# EAGLE design adc2_v2 (EAGLE 5.12)
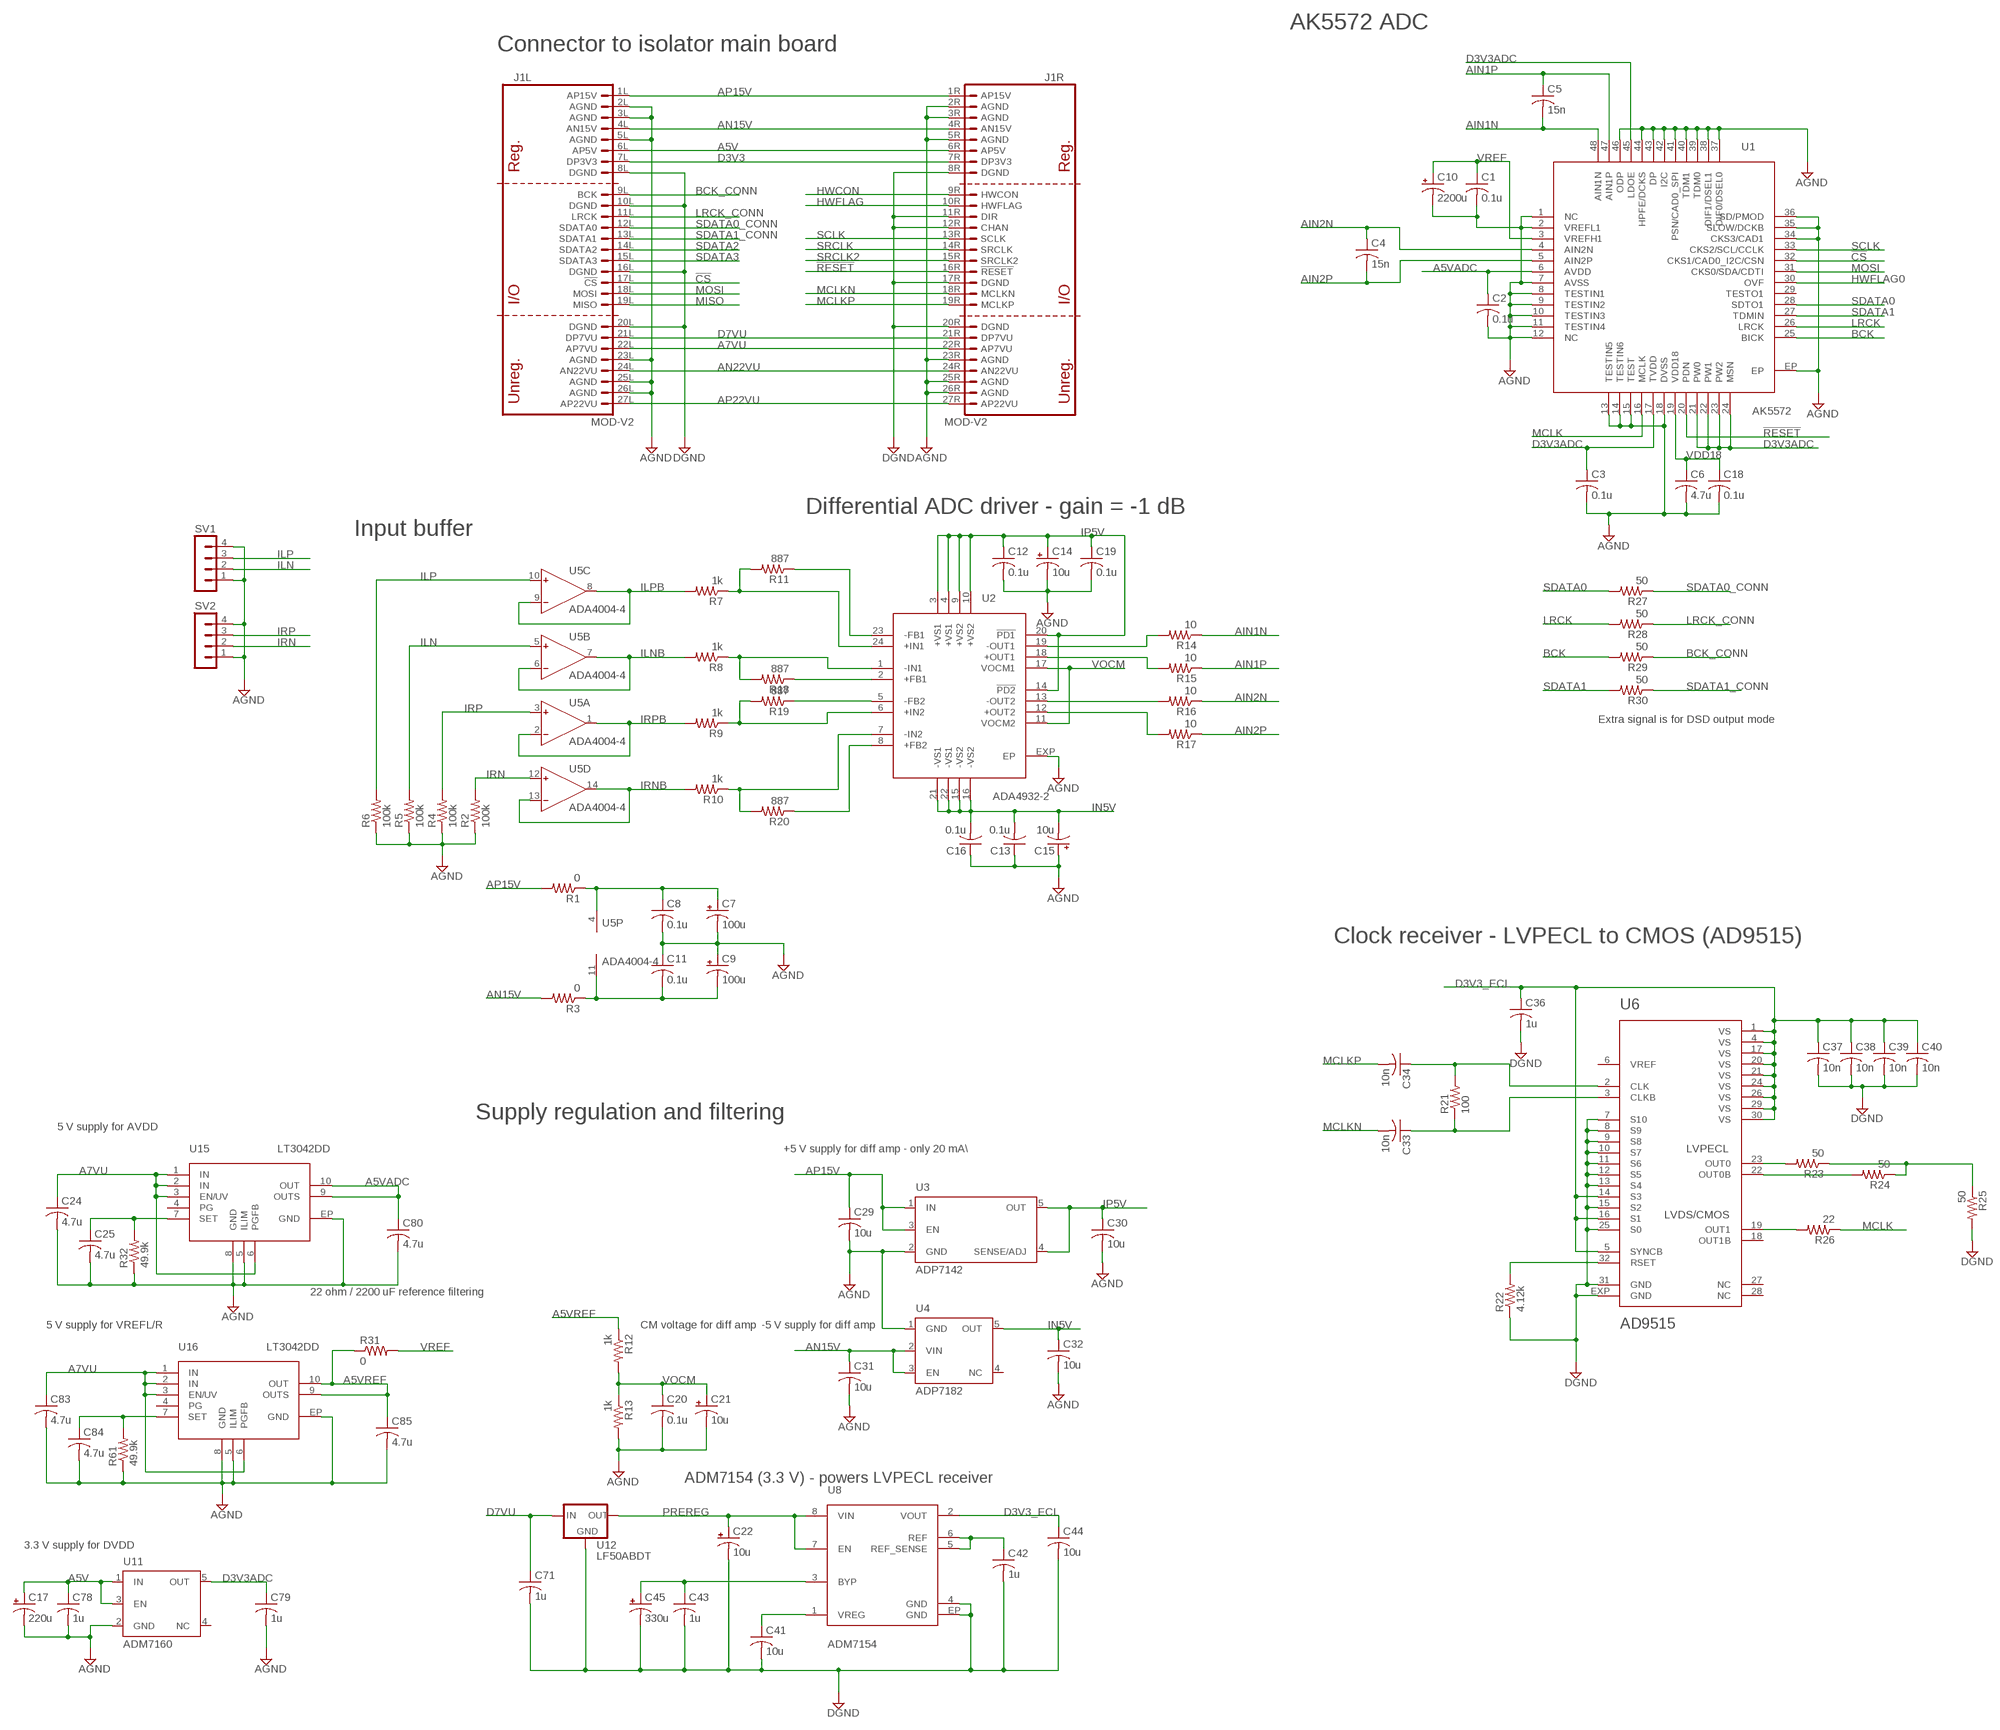
[diagram p0: schematic, sheet 1]

## Parts
C1  0.1u  C-USC0603  [C0603]
C2  0.1u  C-USC0603  [C0603]
C3  0.1u  C-USC0603  [C0603]
C4  15n  C-USC0603  [C0603]
C5  15n  C-USC0603  [C0603]
C6  4.7u  C-USC1206  [C1206]
C7  100u  CPOL-USE  [PANASONIC_E]
C8  0.1u  C-USC0603  [C0603]
C9  100u  CPOL-USE  [PANASONIC_E]
C10  2200u  CPOL-US  [PANASONIC_H13]
C11  0.1u  C-USC0603  [C0603]
C12  0.1u  C-USC0603  [C0603]
C13  0.1u  C-USC0603  [C0603]
C14  10u  CPOL-USB  [PANASONIC_B]
C15  10u  CPOL-USB  [PANASONIC_B]
C16  0.1u  C-USC0603  [C0603]
C17  220u  CPOL-USD  [PANASONIC_D]
C18  0.1u  C-USC0603  [C0603]
C19  0.1u  C-USC0603  [C0603]
C20  0.1u  C-USC0603  [C0603]
C21  10u  CPOL-USB  [PANASONIC_B]
C22  10u  CPOL-USB  [PANASONIC_B]
C24  4.7u  C-USC1206  [C1206]
C25  4.7u  C-USC1206  [C1206]
C29  10u  C-USC1206  [C1206]
C30  10u  C-USC1206  [C1206]
C31  10u  C-USC1206  [C1206]
C32  10u  C-USC1206  [C1206]
C33  10n  C-USC0603  [C0603]
C34  10n  C-USC0603  [C0603]
C36  1u  C-USC0805  [C0805]
C37  10n  C-USC0402  [C0402]
C38  10n  C-USC0402  [C0402]
C39  10n  C-USC0402  [C0402]
C40  10n  C-USC0402  [C0402]
C41  10u  C-USC1206  [C1206]
C42  1u  C-USC0805  [C0805]
C43  1u  C-USC0805  [C0805]
C44  10u  C-USC1206  [C1206]
C45  330u  CPOL-USCT7343  [CT7343]
C71  1u  C-USC0805  [C0805]
C78  1u  C-USC0603  [C0603]
C79  1u  C-USC0603  [C0603]
C80  4.7u  C-USC1206  [C1206]
C83  4.7u  C-USC1206  [C1206]
C84  4.7u  C-USC1206  [C1206]
C85  4.7u  C-USC1206  [C1206]
J1  MOD-V2  [MOD-V2]
R1  0  R-US_R0603  [R0603]
R2  100k  R-US_R0603  [R0603]
R3  0  R-US_R0603  [R0603]
R4  100k  R-US_R0603  [R0603]
R5  100k  R-US_R0603  [R0603]
R6  100k  R-US_R0603  [R0603]
R7  1k  R-US_R0603  [R0603]
R8  1k  R-US_R0603  [R0603]
R9  1k  R-US_R0603  [R0603]
R10  1k  R-US_R0603  [R0603]
R11  887  R-US_R0603  [R0603]
R12  1k  R-US_R0603  [R0603]
R13  1k  R-US_R0603  [R0603]
R14  10  R-US_R0603  [R0603]
R15  10  R-US_R0603  [R0603]
R16  10  R-US_R0603  [R0603]
R17  10  R-US_R0603  [R0603]
R18  887  R-US_R0603  [R0603]
R19  887  R-US_R0603  [R0603]
R20  887  R-US_R0603  [R0603]
R21  100  R-US_R0603  [R0603]
R22  4.12k  R-US_R0603  [R0603]
R23  50  R-US_R0603  [R0603]
R24  50  R-US_R0603  [R0603]
R25  50  R-US_R0603  [R0603]
R26  22  R-US_R0603  [R0603]
R27  50  R-US_R0603  [R0603]
R28  50  R-US_R0603  [R0603]
R29  50  R-US_R0603  [R0603]
R30  50  R-US_R0603  [R0603]
R31  0  R-US_R0603  [R0603]
R32  49.9k  R-US_R0603  [R0603]
R61  49.9k  R-US_R0603  [R0603]
SV1  MA04-1  [MA04-1]
SV2  MA04-1  [MA04-1]
U1  AK5572  [QFN48_EP_AKM]
U2  ADA4932-2  [LFCSP24]
U3  ADP7142  [SOT23-DBV]
U4  ADP7182  [SOT23-DBV]
U5  ADA4004-4  AD8644R  [SO14]
U6  AD9515  [LFCSP32]
U8  ADM7154  [SO8-EP]
U11  ADM7160  [SOT23-DBV]
U12  LF50ABDT  78XXS  [DPACK]
U15  LT3042DD  [DFN10]
U16  LT3042DD  [DFN10]

## Nets
!CS: J1.17L(L:!CS) U1.32(CKS1/CAD0_I2C/CSN)
!RESET: J1.16R(R:!RESET) U1.20(PDN)
A5V: C17.+ C78.1 J1.6L(L:AP5V) J1.6R(R:AP5V) U11.1(IN) U11.3(EN)
A5VADC: C2.1 C80.1 U1.6(AVDD) U15.9(OUTS) U15.10(OUT)
A5VREF: C85.1 R12.1 R31.1 U16.9(OUTS) U16.10(OUT)
A7VU: C24.1 C83.1 J1.22L(L:AP7VU) J1.22R(R:AP7VU) U15.1(IN) U15.2(IN) U15.3(EN/UV) U15.6(PGFB) U16.1(IN) U16.2(IN) U16.3(EN/UV) U16.6(PGFB)
AGND: C1.2 C2.2 C3.2 C6.2 C7.- C8.2 C9.+ C10.- C11.1 C12.2 C13.1 C14.- C15.+ C16.1 C17.- C18.2 C19.2 C20.2 C21.- C24.2 C25.2 C29.2 C30.2 C31.2 C32.2 C78.2 C79.2 C80.2 C83.2 C84.2 C85.2 J1.2L(L:AGND) J1.2R(R:AGND) J1.3L(L:AGND) J1.3R(R:AGND) J1.5L(L:AGND) J1.5R(R:AGND) J1.23L(L:AGND) J1.23R(R:AGND) J1.25L(L:AGND) J1.25R(R:AGND) J1.26L(L:AGND) J1.26R(R:AGND) R2.1 R4.1 R5.1 R6.1 R13.2 R32.1 R61.1 SV1.1 SV1.4 SV2.1 SV2.4 U1.1(NC) U1.2(VREFL1) U1.7(AVSS) U1.8(TESTIN1) U1.9(TESTIN2) U1.10(TESTIN3) U1.11(TESTIN4) U1.12(NC) U1.13(TESTIN5) U1.14(TESTIN6) U1.15(TEST) U1.18(DVSS) U1.34(CKS3/CAD1) U1.35(SLOW/DCKB) U1.36(SD/PMOD) U1.37(DIF0/DSEL0) U1.38(DIF1/DSEL1) U1.39(TDM0) U1.40(TDM1) U1.41(PSN/CAD0_SPI) U1.42(I2C) U1.43(DP) U1.44(HPFE/DCKS) U1.46(ODP) U1.EP U2.EXP(EP) U3.2(GND) U4.1(GND) U11.2(GND) U15.5(ILIM) U15.8(GND) U15.EP(GND) U16.5(ILIM) U16.8(GND) U16.EP(GND)
AIN1N: C5.2 R14.1 U1.48(AIN1N)
AIN1P: C5.1 R15.1 U1.47(AIN1P)
AIN2N: C4.1 R16.1 U1.4(AIN2N)
AIN2P: C4.2 R17.1 U1.5(AIN2P)
AN15V: C31.1 J1.4L(L:AN15V) J1.4R(R:AN15V) R3.2 U4.2(VIN) U4.3(EN)
AN22VU: J1.24L(L:AN22VU) J1.24R(R:AN22VU)
AP15V: C29.1 J1.1L(L:AP15V) J1.1R(R:AP15V) R1.2 U3.1(IN) U3.3(EN)
AP22VU: J1.27L(L:AP22VU) J1.27R(R:AP22VU)
BCK: R29.2 U1.25(BICK)
BCK_CONN: J1.9L(L:BCK) R29.1
D3V3: J1.7L(L:DP3V3) J1.7R(R:DP3V3)
D3V3_ECL: C36.1 C37.1 C38.1 C39.1 C40.1 C44.1 U6.1(VS) U6.4(VS) U6.5(SYNCB) U6.14(S3) U6.16(S1) U6.17(VS) U6.20(VS) U6.21(VS) U6.24(VS) U6.26(VS) U6.29(VS) U6.30(VS) U8.2(VOUT)
D3V3ADC: C3.1 C79.1 U1.17(TVDD) U1.21(PW0) U1.22(PW1) U1.23(PW2) U1.24(MSN) U1.45(LDOE) U11.5(OUT)
D7VU: C71.1 J1.21L(L:DP7VU) J1.21R(R:DP7VU) U12.1(IN)
DGND: C22.- C36.2 C37.2 C38.2 C39.2 C40.2 C41.2 C42.2 C43.2 C44.2 C45.- C71.2 J1.8L(L:DGND) J1.8R(R:DGND) J1.10L(L:DGND) J1.11R(R:DIR) J1.12R(R:CHAN) J1.16L(L:DGND) J1.17R(R:DGND) J1.20L(L:DGND) J1.20R(R:DGND) R22.1 R25.2 U6.7(S10) U6.8(S9) U6.9(S8) U6.10(S7) U6.11(S6) U6.12(S5) U6.13(S4) U6.15(S2) U6.25(S0) U6.31(GND) U6.EXP(GND) U8.4(GND) U8.EP(GND) U12.4(GND)
HWCON: J1.9R(R:HWCON)
HWFLAG: J1.10R(R:HWFLAG)
HWFLAG0: U1.30(OVF)
ILN: R5.2 SV1.2 U5.5(B:IN+)
ILNB: R8.2 U5.6(B:IN-) U5.7(B:OUT)
ILP: R6.2 SV1.3 U5.10(C:IN+)
ILPB: R7.2 U5.8(C:OUT) U5.9(C:IN-)
IN5V: C13.2 C15.- C16.2 C32.1 U2.15(-VS2) U2.16(-VS2) U2.21(-VS1) U2.22(-VS1) U4.5(OUT)
IP5V: C12.1 C14.+ C19.1 C30.1 U2.3(+VS1) U2.4(+VS1) U2.9(+VS2) U2.10(+VS2) U2.14(!PD2) U2.20(!PD1) U3.4(SENSE/ADJ) U3.5(OUT)
IRN: R2.2 SV2.2 U5.12(D:IN+)
IRNB: R10.2 U5.13(D:IN-) U5.14(D:OUT)
IRP: R4.2 SV2.3 U5.3(A:IN+)
IRPB: R9.2 U5.1(A:OUT) U5.2(A:IN-)
LRCK: R28.2 U1.26(LRCK)
LRCK_CONN: J1.11L(L:LRCK) R28.1
MCLK: R26.1 U1.16(MCLK)
MCLKN: C33.2 J1.18R(R:MCLKN)
MCLKP: C34.2 J1.19R(R:MCLKP)
MISO: J1.19L(L:MISO)
MOSI: J1.18L(L:MOSI) U1.31(CKS0/SDA/CDTI)
N$1: C9.- C11.2 R3.1 U5.11(P:V-)
N$2: R7.1 R11.2 U2.24(+IN1)
N$3: R15.2 U2.18(+OUT1)
N$4: R14.2 U2.19(-OUT1)
N$5: R16.2 U2.13(-OUT2)
N$6: R17.2 U2.12(+OUT2)
N$7: R8.1 R18.2 U2.1(-IN1)
N$8: R9.1 R19.2 U2.6(+IN2)
N$11: R10.1 R20.2 U2.7(-IN2)
N$12: R18.1 U2.2(+FB1)
N$13: R19.1 U2.5(-FB2)
N$14: R11.1 U2.23(-FB1)
N$15: R20.1 U2.8(+FB2)
N$16: C34.1 R21.2 U6.2(CLK)
N$17: C33.1 R21.1 U6.3(CLKB)
N$18: R23.2 U6.23(OUT0)
N$19: C41.1 U8.1(VREG)
N$20: C7.+ C8.1 R1.1 U5.4(P:V+)
N$22: R26.2 U6.19(OUT1)
N$25: R24.2 U6.22(OUT0B)
N$26: C43.1 C45.+ U8.3(BYP)
N$27: R22.2 U6.32(RSET)
N$28: C42.1 U8.5(REF_SENSE) U8.6(REF)
N$29: R23.1 R24.1 R25.1
N$72: C25.1 R32.2 U15.7(SET)
N$73: C84.1 R61.2 U16.7(SET)
PREREG: C22.+ U8.7(EN) U8.8(VIN) U12.3(OUT)
SCLK: J1.13R(R:SCLK) U1.33(CKS2/SCL/CCLK)
SDATA0: R27.2 U1.28(SDTO1)
SDATA0_CONN: J1.12L(L:SDATA0) R27.1
SDATA1: R30.2 U1.27(TDMIN)
SDATA1_CONN: J1.13L(L:SDATA1) R30.1
SDATA2: J1.14L(L:SDATA2)
SDATA3: J1.15L(L:SDATA3)
SRCLK: J1.14R(R:SRCLK)
SRCLK2: J1.15R(R:SRCLK2)
VDD18: C6.1 C18.1 U1.19(VDD18)
VOCM: C20.1 C21.+ R12.2 R13.1 U2.11(VOCM2) U2.17(VOCM1)
VREF: C1.1 C10.+ R31.2 U1.3(VREFH1)
Unconnected: U1.29(TESTO1) U4.4(NC) U6.6(VREF) U6.18(OUT1B) U6.27(NC) U6.28(NC) U11.4(NC) U15.4(PG) U16.4(PG)

## Notes on the sheet
- AK5572 ADC
- Connector to isolator main board
- Differential ADC driver - gain = -1 dB
- Input buffer
- Extra signal is for DSD output mode
- Clock receiver - LVPECL to CMOS (AD9515)
- Supply regulation and filtering
- 5 V supply for AVDD
- +5 V supply for diff amp - only 20 mA\
- 22 ohm / 2200 uF reference filtering
- 5 V supply for VREFL/R | CM voltage for diff amp | -5 V supply for diff amp
- ADM7154 (3.3 V) - powers LVPECL receiver
- 3.3 V supply for DVDD

## Library data of the parts
C1-C6 C8 C11-C13 C16 C18-C20 C24 C25 C29-C34 C36-C44 C71 C78-C80 C83-C85 = rcl:C-US: CAPACITOR, American symbol
C7 C9 C14 C15 C17 C21 C22 C45 = rcl:CPOL-US: POLARIZED CAPACITOR, American symbol
C10 = cdp:CPOL-US
J1 = cdp:MOD-V2
R1-R32 R61 = rcl:R-US_: RESISTOR, American symbol
SV1 SV2 = con-lstb:MA04-1: PIN HEADER; OC_FARNELL: unknown; OC_NEWARK: unknown
U1 = cdp:AK5572
U2 = cdp:ADA4932-2
U3 = cdp:ADP7142
U4 = cdp:ADP7182
U5 = analog-devices:AD8644: Single and Quad 18 V Operational Amplifiers Source: http://www.analog.com/static/imported-files/data_sheets/AD8614_8644.pdf; MF: ALTERA CORPORATION; MPN: AD8644ARZ; OC_FARNELL: 1438873; OC_NEWARK: 59K7037
U6 = cdp:AD9515
U8 = cdp:ADM7154
U11 = cdp:ADM7160
U12 = cdp:78XXS: VOLTAGE REGULATOR
U15 U16 = cdp:LT3042

## Board
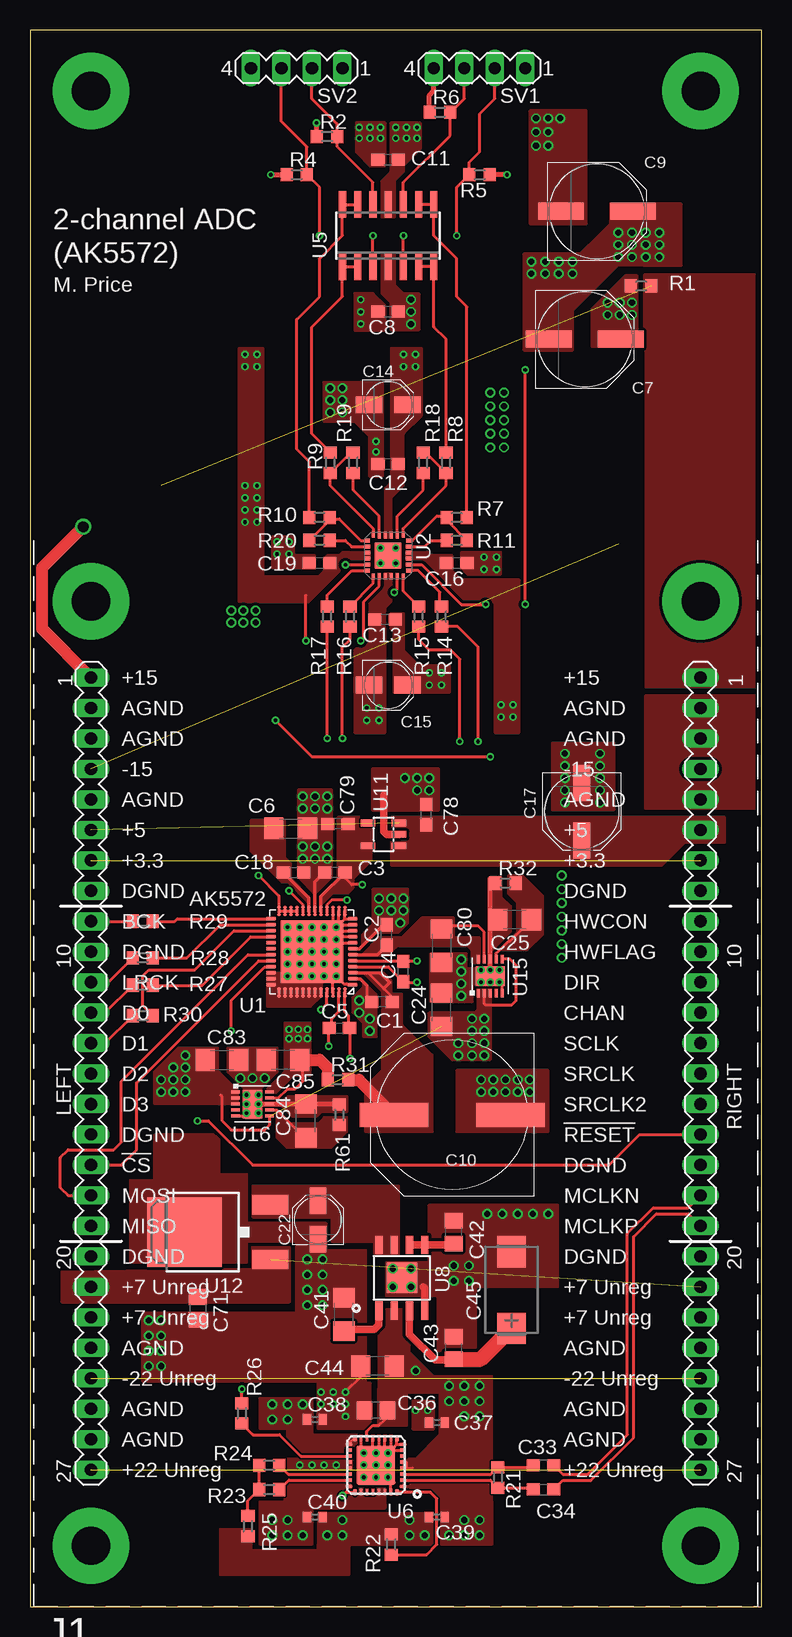
[diagram p1: board, top side]
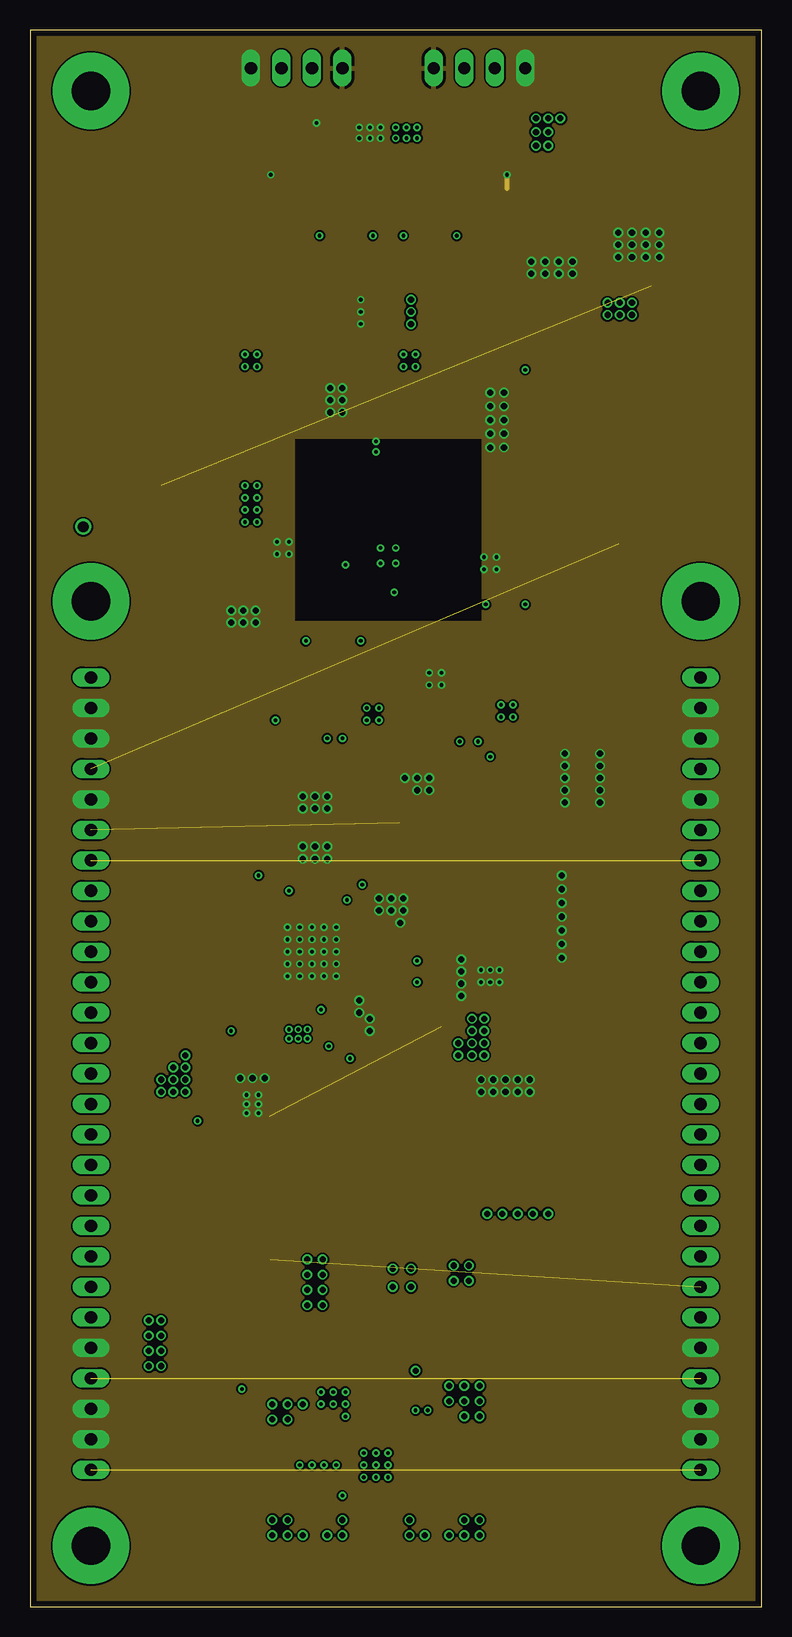
[diagram p2: board, inner layer Route2]
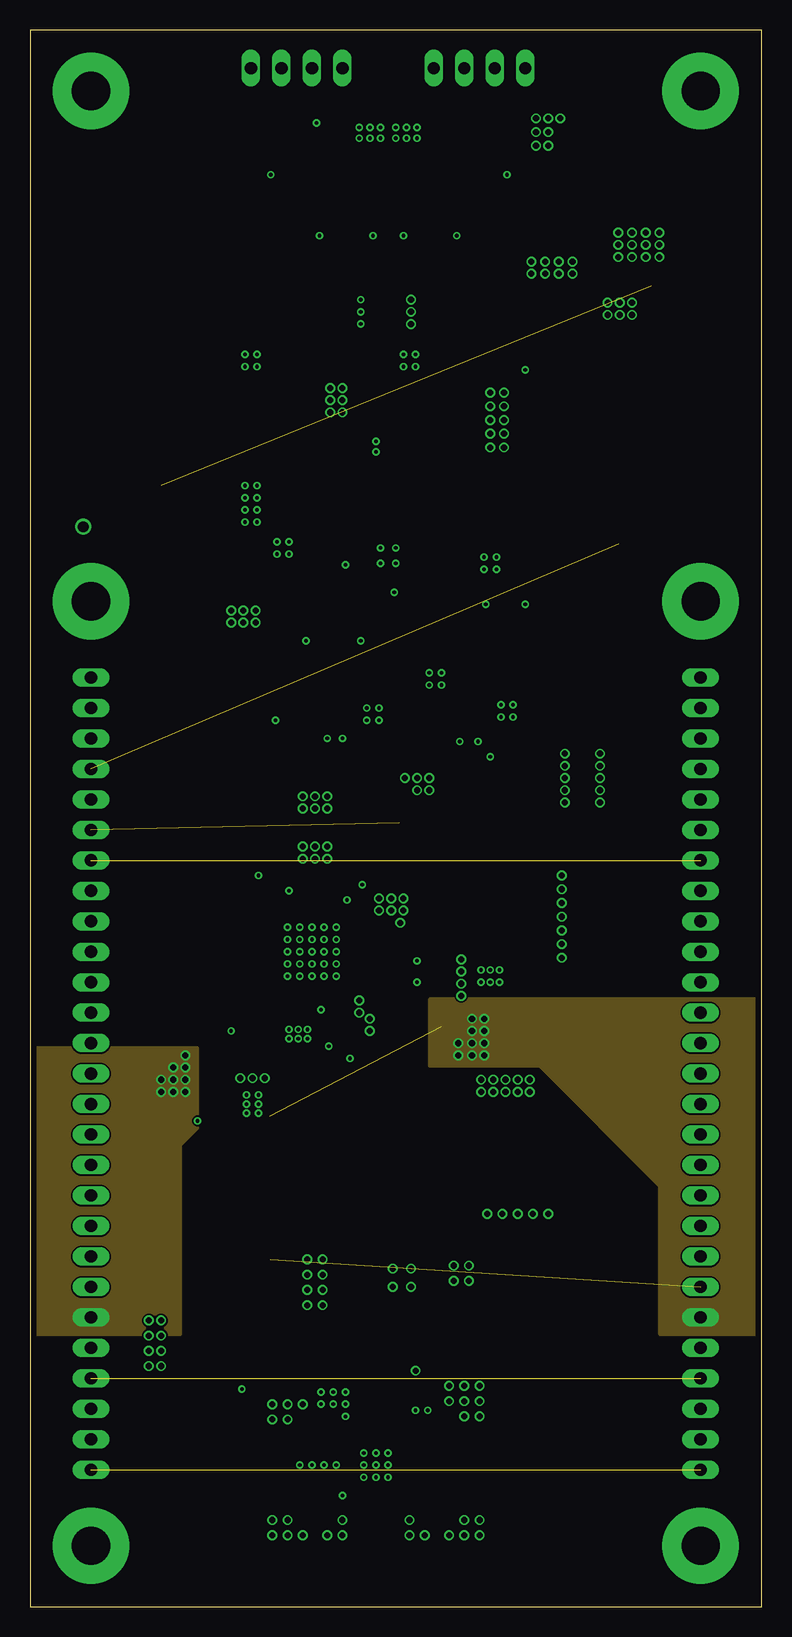
[diagram p3: board, inner layer Route15]
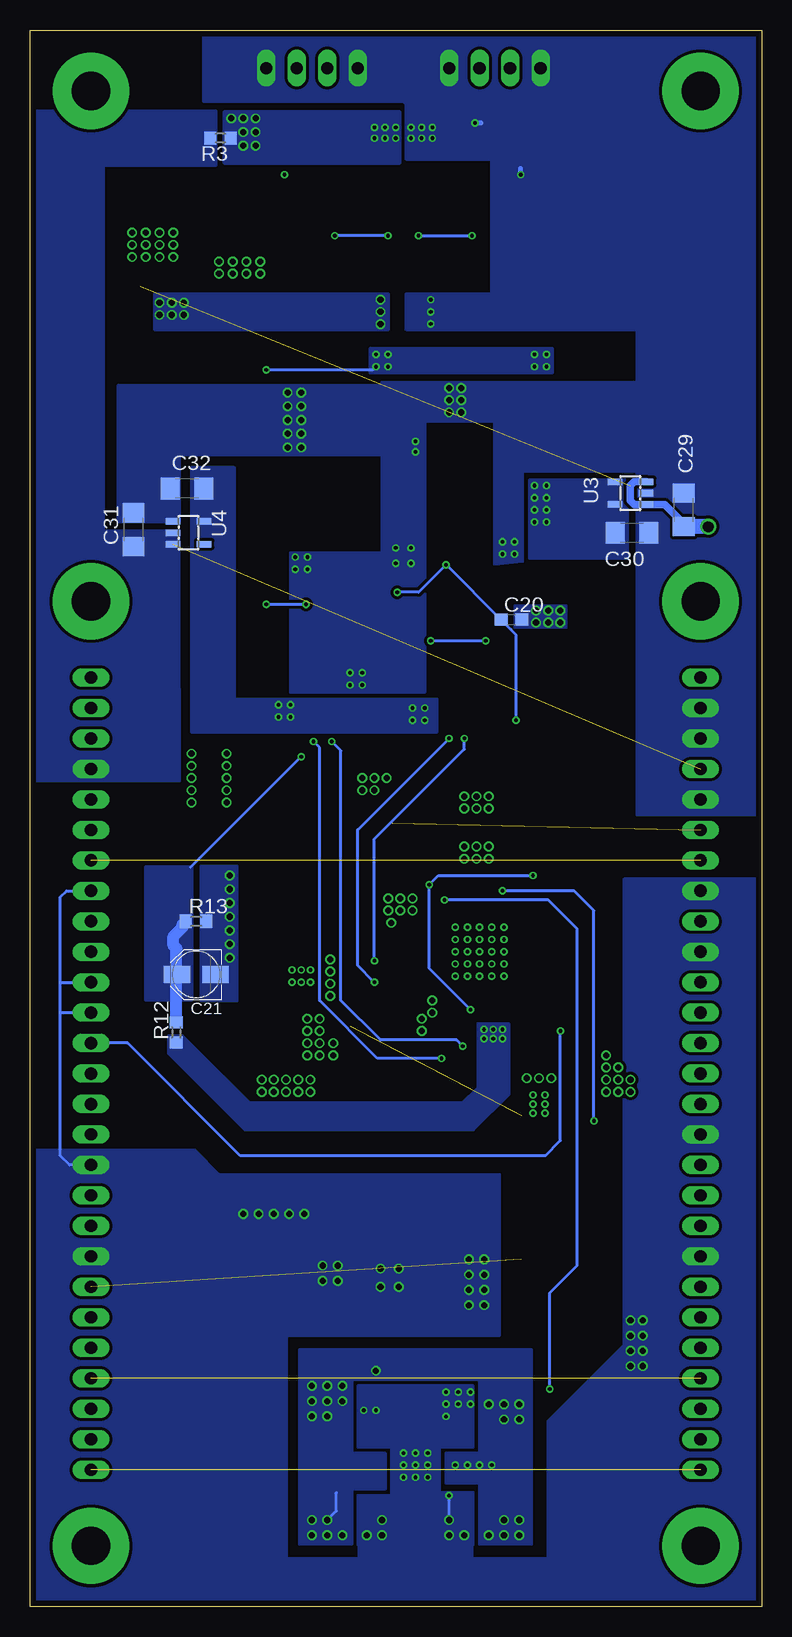
[diagram p4: board, bottom side, seen from below]

Size 60.96 x 131.44 mm. Coordinates in mm from the lower left corner, seen from the top.
Outline: 0,0 60.96,0 60.96,131.44 0,131.44 0,0
Copper layers (1*2*15*16): Top 0.035mm / dielectric 0.2mm / Route2 0.035mm / dielectric 1.2mm / Route15 0.035mm / dielectric 0.2mm / Bottom 0.035mm
Design rules "Elecrow_4-layer_PCB_eagle_rule": minimum track width 6mil, minimum drill 12mil, track to track 6mil, track to pad 6mil, pad to pad 6mil, via to via 8mil, smd to smd 0mil, copper to edge 20mil, drill to drill 10mil, minimum pad ring 6mil, minimum via ring 6mil, stop-mask expansion 0mil, vias tented up to drill 100mil, thermal gap 10mil

### Footprints (pad centres in the part's own frame; a part is rotated, then mirrored left to right if it is on the bottom)
C0603 = smd 1.1 x 1: 1 -0.85,0; 2 0.85,0
C1206 = smd 1.6 x 1.8: 1 -1.4,0; 2 1.4,0
PANASONIC_E = smd 3.8 x 1.4: + 3,0; - -3,0
PANASONIC_H13 = smd 5.7 x 2: + 4.85,0; - -4.85,0
PANASONIC_B = smd 2.2 x 1.4: + 1.6,0; - -1.6,0
PANASONIC_D = smd 3 x 1.4: + 2.4,0; - -2.4,0
C0805 = smd 1.3 x 1.5: 1 -0.95,0; 2 0.95,0
C0402 = smd 0.7 x 0.9: 1 -0.65,0; 2 0.65,0
CT7343 = smd 2.6 x 2.4: + -3.2,0; - 3.2,0
MOD-V2 = drill 1.016 long: 1L -25.4,33.02; 1R 25.4,33.02; 2L -25.4,30.48; 2R 25.4,30.48; 3L -25.4,27.94; 3R 25.4,27.94; 4L -25.4,25.4; 4R 25.4,25.4; 5L -25.4,22.86; 5R 25.4,22.86; 6L -25.4,20.32; 6R 25.4,20.32; 7L -25.4,17.78; 7R 25.4,17.78; 8L -25.4,15.24; 8R 25.4,15.24; 9L -25.4,12.7; 9R 25.4,12.7; 10L -25.4,10.16; 10R 25.4,10.16; 11L -25.4,7.62; 11R 25.4,7.62; 12L -25.4,5.08; 12R 25.4,5.08; 13L -25.4,2.54; 13R 25.4,2.54; 14L -25.4,0; 14R 25.4,0; 15L -25.4,-2.54; 15R 25.4,-2.54; 16L -25.4,-5.08; 16R 25.4,-5.08; 17L -25.4,-7.62; 17R 25.4,-7.62; 18L -25.4,-10.16; 18R 25.4,-10.16; 19L -25.4,-12.7; 19R 25.4,-12.7; 20L -25.4,-15.24; 20R 25.4,-15.24; 21L -25.4,-17.78; 21R 25.4,-17.78; 22L -25.4,-20.32; 22R 25.4,-20.32; 23L -25.4,-22.86; 23R 25.4,-22.86; 24L -25.4,-25.4; 24R 25.4,-25.4; 25L -25.4,-27.94; 25R 25.4,-27.94; 26L -25.4,-30.48; 26R 25.4,-30.48; 27L -25.4,-33.02; 27R 25.4,-33.02 | drill 3.175 pad 6.35 round: DP1 -25.4,39.37; DP2 25.4,39.37; DP3 -25.4,-39.37; DP4 25.4,-39.37
R0603 = smd 1 x 1.1: 1 -0.85,0; 2 0.85,0
MA04-1 = drill 1.016 long: 1 -3.81,0; 2 -1.27,0; 3 1.27,0; 4 3.81,0
QFN48_EP_AKM = smd 0.8 x 0.3: 1 -3.4,2.75; 2 -3.4,2.25; 3 -3.4,1.75; 4 -3.4,1.25; 5 -3.4,0.75; 6 -3.4,0.25; 7 -3.4,-0.25; 8 -3.4,-0.75; 9 -3.4,-1.25; 10 -3.4,-1.75; 11 -3.4,-2.25; 12 -3.4,-2.75; 25 3.4,-2.75; 26 3.4,-2.25; 27 3.4,-1.75; 28 3.4,-1.25; 29 3.4,-0.75; 30 3.4,-0.25; 31 3.4,0.25; 32 3.4,0.75; 33 3.4,1.25; 34 3.4,1.75; 35 3.4,2.25; 36 3.4,2.75 | smd 0.3 x 0.8: 13 -2.75,-3.4; 14 -2.25,-3.4; 15 -1.75,-3.4; 16 -1.25,-3.4; 17 -0.75,-3.4; 18 -0.25,-3.4; 19 0.25,-3.4; 20 0.75,-3.4; 21 1.25,-3.4; 22 1.75,-3.4; 23 2.25,-3.4; 24 2.75,-3.4; 37 2.75,3.4; 38 2.25,3.4; 39 1.75,3.4; 40 1.25,3.4; 41 0.75,3.4; 42 0.25,3.4; 43 -0.25,3.4; 44 -0.75,3.4; 45 -1.25,3.4; 46 -1.75,3.4; 47 -2.25,3.4; 48 -2.75,3.4 | smd 5.2 x 5.2: EP 0,0
LFCSP24 = smd 0.5 x 0.3: 1 -1.75,1.25; 6 -1.75,-1.25; 13 1.75,-1.25; 18 1.75,1.25 | smd 0.55 x 0.3: 2 -1.725,0.75; 3 -1.725,0.25; 4 -1.725,-0.25; 5 -1.725,-0.75; 14 1.725,-0.75; 15 1.725,-0.25; 16 1.725,0.25; 17 1.725,0.75 | smd 0.3 x 0.5: 7 -1.25,-1.75; 12 1.25,-1.75; 19 1.25,1.75; 24 -1.25,1.75 | smd 0.3 x 0.55: 8 -0.75,-1.725; 9 -0.25,-1.725; 10 0.25,-1.725; 11 0.75,-1.725; 20 0.75,1.725; 21 0.25,1.725; 22 -0.25,1.725; 23 -0.75,1.725 | smd 2.25 x 2.25: EXP 0,0
SOT23-DBV = smd 0.55 x 1.2: 1 -0.95,-1.3; 2 0,-1.3; 3 0.95,-1.3; 4 0.95,1.3; 5 -0.95,1.3
SO14 = smd 0.6 x 2.2: 1 -3.81,-2.6; 2 -2.54,-2.6; 3 -1.27,-2.6; 4 0,-2.6; 5 1.27,-2.6; 6 2.54,-2.6; 7 3.81,-2.6; 8 3.81,2.6; 9 2.54,2.6; 10 1.27,2.6; 11 0,2.6; 12 -1.27,2.6; 13 -2.54,2.6; 14 -3.81,2.6
LFCSP32 = smd 0.55 x 0.3: 1 -2.25,1.75; 2 -2.25,1.25; 3 -2.25,0.75; 4 -2.25,0.25; 5 -2.25,-0.25; 6 -2.25,-0.75; 7 -2.25,-1.25; 8 -2.25,-1.75; 17 2.25,-1.75; 18 2.25,-1.25; 19 2.25,-0.75; 20 2.25,-0.25; 21 2.25,0.25; 22 2.25,0.75; 23 2.25,1.25; 24 2.25,1.75 | smd 0.3 x 0.55: 9 -1.75,-2.25; 10 -1.25,-2.25; 11 -0.75,-2.25; 12 -0.25,-2.25; 13 0.25,-2.25; 14 0.75,-2.25; 15 1.25,-2.25; 16 1.75,-2.25; 25 1.75,2.25; 26 1.25,2.25; 27 0.75,2.25; 28 0.25,2.25; 29 -0.25,2.25; 30 -0.75,2.25; 31 -1.25,2.25; 32 -1.75,2.25 | smd 3.25 x 3.25: EXP 0,0
SO8-EP = smd 0.61 x 1.524: 1 -1.905,-2.743; 2 -0.635,-2.743; 3 0.635,-2.743; 4 1.905,-2.743; 5 1.905,2.743; 6 0.635,2.743; 7 -0.635,2.743; 8 -1.905,2.743 | smd 2.54 x 2.54: EP 0,0
DPACK = smd 1.6 x 3: 1 -2.28,-4.8; 3 2.28,-4.8 | smd 5.8 x 6.2: 4 0,2.38
DFN10 = smd 0.25 x 0.7: 1 -1,-1.425; 2 -0.5,-1.425; 3 0,-1.425; 4 0.5,-1.425; 5 1,-1.425; 6 1,1.425; 7 0.5,1.425; 8 0,1.425; 9 -0.5,1.425; 10 -1,1.425 | smd 2.38 x 1.65: EP 0,0

### Placement (x,y rotation side)
C1  29.34,50.42 180 top
C2  29.72,56.01 90 top
C3  25.4,61.21 180 top
C4  31.11,52.96 90 top
C5  25.78,48.26 0 top
C6  21.72,64.9 0 top
C7  46.23,105.66 0 top
C8  29.84,107.95 180 top
C9  47.24,116.33 0 top
C10  35.18,41.02 180 top
C11  29.84,120.65 0 top
C12  29.84,95.25 180 top
C13  29.59,82.3 180 top
C14  29.84,100.2 0 top
C15  29.84,76.83 0 top
C16  35.56,87 180 top
C17  45.97,66.29 270 top
C18  21.97,61.21 0 top
C19  24.13,87 180 top
C20  20.83,82.3 0 bottom
C21  47.12,52.7 180 bottom
C22  24,32.26 90 top
C24  34.29,49.78 90 top
C25  40.39,57.28 180 top
C29  6.48,91.44 90 bottom
C30  10.79,89.53 0 bottom
C31  52.32,89.79 90 bottom
C32  47.88,93.22 180 bottom
C33  42.8,11.81 0 top
C34  42.8,9.78 0 top
C36  28.83,16.38 180 top
C37  33.91,15.37 180 top
C38  23.75,15.62 0 top
C39  33.91,7.49 180 top
C40  23.75,7.49 0 top
C41  26.16,24.38 90 top
C42  35.31,31.24 90 top
C43  35.31,21.59 90 top
C44  28.96,20.07 180 top
C45  40.13,26.42 90 top
C71  13.97,24.89 270 top
C78  33.02,66.04 90 top
C79  25.65,65.28 180 top
C80  34.29,55.12 270 top
C83  16,45.59 0 top
C84  22.99,40.51 90 top
C85  21.08,45.59 180 top
J1  30.48,44.45 0 top
R1  50.93,110.11 0 top
R2  24.77,122.56 0 top
R3  45.09,122.43 180 bottom
R4  22.23,119.38 0 top
R5  37.47,119.38 180 top
R6  34.16,124.59 0 top
R7  35.56,90.81 0 top
R8  34.67,95.38 90 top
R9  25.02,95.38 90 top
R10  24.13,90.81 180 top
R11  35.56,88.9 0 top
R12  48.77,47.88 90 bottom
R13  47.12,57.15 0 bottom
R14  34.29,82.55 90 top
R15  32.38,82.55 90 top
R16  26.67,82.55 90 top
R17  24.77,82.55 90 top
R18  32.77,95.38 90 top
R19  26.92,95.38 90 top
R20  24.13,88.9 180 top
R21  38.99,10.79 270 top
R22  30.1,5.21 270 top
R23  19.94,9.78 0 top
R24  19.94,11.81 0 top
R25  18.16,6.73 270 top
R26  17.65,16.13 270 top
R27  9.4,51.82 0 top
R28  9.4,54.1 0 top
R29  9.4,57.15 0 top
R30  9.4,49.28 0 top
R31  25.65,43.94 0 top
R32  39.62,60.33 0 top
R61  25.78,41.02 270 top
SV1  37.47,128.27 180 top
SV2  22.23,128.27 180 top
U1  23.5,54.61 180 top
U2  29.84,87.63 270 top
U3  10.92,92.84 90 bottom
U4  47.75,89.53 270 bottom
U5  29.84,114.3 0 top
U6  28.83,11.81 180 top
U8  30.99,27.43 0 top
U11  29.46,64.39 90 top
U12  15.24,31.24 90 top
U15  38.35,52.58 0 top
U16  18.54,41.91 270 top

### Tracks (layer width: path | path; a pad name or v marks a point on that pad's centre or on a via)
!CS
  Top 0.254: J1.17L 7.62,36.83 8.89,38.1 8.89,43.69 19.06,53.86 U1.32
!RESET  (via drill 0.3 pad 0.51)
  Top 0.254: U1.20 22.75,58.53 v21.59,59.69 | v13.97,40.51 14.86,40.51 18.54,36.83 20.57,36.83 48.26,36.83 50.8,39.37 J1.16R
  Bottom 0.254: v13.97,40.51 13.97,58.04 15.62,59.69 v21.59,59.69
A5V  (1 unrouted)
  pour Top (isolate 0.254, no thermals): 30.1,61.85 52.7,61.85 54.61,63.75 57.91,63.75 57.91,65.79 30.1,65.79
A5VADC
  Top 0.254: U15.9 37.85,56.25 37.34,56.77 34.54,56.77 C80.1
  Top 0.305: U1.6 28.92,54.36 C2.1
  pour Top (no thermals): 37.47,53.72 37.47,55.75 35.31,55.75 35.31,57.4 33.4,57.4 33.4,55.12 36.45,55.12 36.83,54.74 36.83,53.72
  pour Top (no thermals): 27.69,54.36 29.84,54.36 30.48,54.99 30.61,55.12 33.4,55.12 33.4,57.4 32.64,57.4 31.11,55.88 30.99,55.75 29.08,55.75
A5VREF  (via drill 0.3 pad 0.51)
  Top 0.254: U16.9 20.69,42.41 21.46,43.18 22.1,43.18 22.73,43.81 22.73,45.34 C85.1
  Top 1.016: R31.1 24.8,44.92 24.13,45.59 C85.1
  other vias: 21.59,48.13 22.35,48.13 23.11,48.13 23.11,47.37 22.35,47.37 21.59,47.37
  pour Top (no thermals): 21.21,48.64 21.21,44.58 19.81,43.18 19.81,42.93 20.57,42.93 21.97,44.32 23.37,44.32 23.37,48.64
  pour Bottom (no thermals): 49.4,47.62 48.26,47.62 42.67,42.04 24.89,42.04 23.62,43.31 23.62,48.64 21.08,48.64 21.08,42.67 24,39.75 43.05,39.75 49.4,46.1
A7VU  (via drill 0.51 pad 0.81)  (1 unrouted)
  Top 0.254: U15.6 39.98,54 40.51,53.47 40.51,50.55 40.13,50.16 37.97,50.16 37.85,50.29 U15.2 | U16.6 19.97,40.16 19.56,39.75 16.76,39.75 16,40.51 16,42.55 15.88,42.67
  other vias: 12.95,45.97 12.95,44.96 12.95,43.94 12.95,42.93 11.94,44.96 11.94,43.94 11.94,42.93 10.92,43.94 10.92,42.93 37.85,49.02 36.83,49.02 37.85,48.01 36.83,48.01 37.85,46.99 36.83,46.99 36.83,45.97 37.85,45.97 35.69,46.99 35.69,45.97
  pour Top (no thermals): 33.27,49.53 37.08,49.53 37.34,49.78 37.34,51.44 38.35,51.44 38.35,45.59 35.18,45.59 34.67,46.1 33.27,47.5
  pour Top (no thermals): 10.41,46.61 15.62,46.61 15.62,44.7 17.27,43.05 17.27,41.91 10.41,41.91
  pour Route15 (no thermals): 0.13,22.73 12.57,22.73 12.57,38.48 13.97,39.88 13.97,46.61 0.13,46.61
  pour Route15 (no thermals): 52.58,22.73 60.83,22.73 60.83,50.67 33.27,50.67 33.27,45.09 42.42,45.09 52.45,35.05 52.45,22.73
AGND  (via drill 0.3 pad 0.51, 0.51 pad 0.81)
  Top 0.254: U2.EXP v29.21,88.27 | U1.46 25.25,52.3 v25.53,52.58 26.16,51.94 26.42,51.94 26.5,51.86 U1.1 | v23.5,56.64 23.75,56.89 | U15.8 38.35,56.65 C25.2 | U15.5 39.35,52.47 39.24,52.58 U15.EP | U16.5 18.43,40.91 18.54,41.02 U16.EP | 28.07,51.82 28.07,50.84 C1.2 | U1.15 25.25,56.92 v25.53,56.64 | 25.75,56.86 U1.14 | 26.25,57.36 U1.13 | v25.53,56.64 26.25,57.36 | 26.25,57.36 U1.12 | 25.75,56.86 U1.11 | v25.53,56.64 25.75,56.86 | U1.10 25.81,56.36 v25.53,56.64 | U1.9 25.76,55.86 v25.53,55.63 25.79,55.36 U1.8
  Top 0.305: U1.2 27.52,52.36 28.07,51.82 | U1.7 27.43,54.86 29.21,56.64 29.5,56.64 C2.2 | U1.18 23.75,60.41 C3.2
  Top 0.406: v20.07,119.38 R4.1 | R2.1 23.88,122.59 v23.88,123.7 | R6.1 33.27,124.63 33.27,125.98 33.66,126.36 SV1.4 | U15.EP 38.35,60.71 38.39,60.71 R32.1 | v39.75,119.38 R5.1 | U16.EP v19.05,41.91 U16.8 25.74,41.91 R61.1
  Top 0.61: U11.2 29.72,64.39 29.46,64.64 29.46,67.69
  Route2 0.406: 39.75,118.24 v39.75,119.38
  Bottom 0.406: v20.07,119.38 20.07,119.89 | v23.88,123.7 23.37,123.7
  other vias: 30.48,88.27 30.48,87 29.21,87 38.86,87.5 37.85,87.5 21.59,88.77 20.57,88.77 20.57,87.76 21.59,87.76 38.86,86.49 37.85,86.49 33.27,77.85 33.27,76.83 34.29,76.83 34.29,77.85 29.21,123.32 29.21,122.43 28.32,123.32 28.32,122.43 27.56,108.97 27.56,107.95 27.56,106.93 22.48,56.64 24.51,56.64 21.46,55.63 22.48,55.63 23.5,55.63 24.51,55.63 21.46,54.61 22.48,54.61 23.5,54.61 24.51,54.61 25.53,54.61 21.46,53.59 22.48,53.59 23.5,53.59 24.51,53.59 25.53,53.59 21.46,52.58 22.48,52.58 23.5,52.58 24.51,52.58 27.43,123.32 27.43,122.43 49.02,114.55 50.16,114.55 51.31,114.55 52.45,114.55 52.45,113.54 51.31,113.54 50.16,113.54 49.02,113.54 49.02,112.52 50.16,112.52 51.31,112.52 52.45,112.52 41.78,112.14 42.93,112.14 44.07,112.14 45.21,112.14 45.21,111.12 44.07,111.12 42.93,111.12 41.78,111.12 21.46,56.64 27.43,50.55 27.43,49.53 28.32,49.02 28.32,48.01 37.59,42.93 38.61,42.93 39.62,42.93 40.64,42.93 41.66,42.93 41.66,43.94 40.64,43.94 39.62,43.94 38.61,43.94 37.59,43.94 17.53,44.07 18.54,44.07 19.56,44.07 18.03,42.67 19.05,42.67 19.05,41.15 18.03,41.15 18.03,41.91 39.12,53.09 39.12,52.07 38.35,52.07 38.35,53.09 37.59,53.09 37.59,52.07 35.94,53.98 35.94,52.96 35.94,51.94 35.94,50.93 29.08,58.04 30.1,58.04 31.11,58.04 30.86,57.02 29.08,59.05 30.1,59.05 31.11,59.05 22.73,62.36 23.75,62.36 24.77,62.36 22.73,63.37 23.75,63.37 24.77,63.37 33.27,69.09 32.26,69.09 31.24,69.09 33.27,68.07 32.26,68.07 44.58,67.06 44.58,68.07 44.58,69.09 44.58,70.1 44.58,71.12 47.5,71.12 47.5,70.1 47.5,69.09 47.5,68.07 47.5,67.06 22.73,66.55 23.75,66.55 24.77,66.55 24.77,67.56 23.75,67.56 22.73,67.56 44.32,60.96 44.32,59.82 44.32,58.67 44.32,57.53 44.32,56.39 44.32,55.24 44.32,54.1 18.8,83.06 18.8,82.04 17.78,82.04 17.78,83.06 16.76,83.06 16.76,82.04 38.35,101.22 39.5,101.22 39.5,100.08 38.35,100.08 38.35,98.93 39.5,98.93 38.35,97.79 39.5,97.79 38.35,96.65 39.5,96.65 25.02,101.6 26.04,101.6 25.02,100.58 25.02,99.57 26.04,100.58 26.04,99.57 28.83,97.16 28.83,96.27
  pour Top (isolate 0.254, no thermals): 29.34,102.11 29.34,94.23 28.32,94.23 28.32,97.54 27.05,98.81 24.51,98.81 24.51,102.11
  pour Top (isolate 0.254, no thermals): 31.11,82.8 31.11,79.76 32.38,78.49 34.92,78.49 34.92,76.2 30.35,76.2 30.35,81.28 30.1,81.53 30.1,82.8
  pour Bottom (isolate 0.254, no thermals): 10.03,102.11 10.03,94.61 19.94,94.61 19.94,87.12 22.23,86.87 22.23,98.81 28.07,98.81 28.07,76.2 39.24,76.2 39.24,87.88 31.62,87.88 31.62,102.11
  pour Top (isolate 0.254, no thermals): 39.24,87.88 35.94,87.88 35.94,86.61 36.45,86.11 39.24,86.11
  pour Top (isolate 0.254, no thermals): 23.75,87.63 21.97,87.63 21.97,89.15 20.19,89.15 20.19,86.61 23.75,86.61
  pour Top (isolate 0.254, no thermals): 29.59,120.14 29.59,123.7 27.18,123.7 27.18,121.28 28.32,120.14
  pour Top (isolate 0.254, no thermals): 29.59,106.43 29.59,108.46 28.57,109.47 27.05,109.47 27.05,106.43
  pour Bottom (isolate 0.254, no thermals): 46.48,131.06 9.27,131.06 9.27,106.43 29.59,106.43 29.59,109.47 22.48,109.47 22.48,120.65 29.59,120.65 29.59,125.22 29.84,125.48 46.48,125.48
  pour Top (isolate 0.254, no thermals): 21.08,57.02 25.91,57.02 25.91,52.2 21.08,52.2
  pour Top (no thermals): 19.81,52.83 24.26,52.83 24.26,50.93 23.37,50.04 19.81,50.04
  pour Top (isolate 0.254, no thermals): 35.56,44.7 35.56,39.62 43.18,39.62 43.18,44.7
  pour Bottom (isolate 0.254, no thermals): 0.25,131.32 10.41,131.32 10.41,76.71 0.25,76.71
  pour Bottom (isolate 0.254, no thermals): 29.97,101.85 29.97,96.01 48.51,96.01 48.51,90.42 53.59,90.42 53.59,101.85
  pour Bottom (isolate 0.254, no thermals): 0.25,86.61 10.41,86.61 10.41,66.04 0.25,66.04
  pour Top (isolate 0.254, no thermals): 51.31,75.95 60.71,75.95 60.71,66.55 51.31,66.55
  pour Route2 (no thermals): 0,0 60.96,0 60.96,131.44 37.72,131.44 37.72,82.04 21.97,82.04 21.97,131.44 0,131.44
  pour Top (no thermals): 33.4,50.42 33.4,54.48 36.32,54.48 36.32,53.21 39.37,53.21 39.37,51.94 36.83,51.94 36.83,50.42
  pour Top (no thermals): 38.35,54.61 38.35,60.83 39.24,60.83 39.24,59.18 40.01,58.42 40.01,56.26
  pour Top (no thermals): 48.39,116.97 54.23,116.97 54.23,111.76 44.96,111.89 48.39,115.32
  pour Top (no thermals): 41.27,104.78 45.21,104.78 45.21,108.08 49.91,112.78 41.15,112.78 41.15,104.78
  pour Top (no thermals): 16.51,46.61 20.57,46.61 20.57,44.58 19.18,43.18 19.18,40.77 17.91,40.77 17.91,43.18 16.51,44.58
  pour Top (no thermals): 20.83,41.91 21.46,42.55 26.42,42.55 26.42,41.27 24.26,41.27 23.88,40.89 21.84,40.89
  pour Top (no thermals): 28.83,51.05 28.83,47.5 27.81,47.5 27.81,48.64 26.92,49.53 26.92,50.8 27.81,51.69 27.81,52.07
  pour Top (no thermals): 27.69,55.12 28.83,56.26 30.73,56.26 31.5,57.02 31.5,59.82 28.57,59.82 28.57,56.9 27.69,56.01
  pour Top (no thermals): 23.75,59.44 25.15,60.83 25.15,68.07 22.35,68.07 22.35,60.83
  pour Top (no thermals): 34.04,66.42 34.04,69.85 28.57,69.85 28.57,66.42
  pour Top (no thermals): 48.64,72.01 48.64,66.42 43.56,66.42 43.56,72.01
  pour Bottom (no thermals): 46.74,61.72 46.74,50.55 43.69,50.55 43.69,61.72
  pour Bottom (no thermals): 20.57,81.66 16.26,81.66 16.26,83.44 20.57,83.44
  pour Route2: 19.94,131.44 38.48,131.44 38.48,97.54 19.94,97.54
AIN1N  (via drill 0.3 pad 0.51)
  Top 0.254: U1.48 26.25,49.57 26.54,49.28 26.54,48.35 C5.2 26.67,48.22 v26.67,45.72 | R14.1 35.65,81.7 37.34,80.01 v37.34,72.14
  Bottom 0.254: v37.34,72.14 36.83,71.63 36.83,50.55 32,45.72 v26.67,45.72
AIN1P  (via drill 0.3 pad 0.51)
  Top 0.254: R15.1 32.38,80.64 33.27,79.76 35.05,79.76 35.81,78.99 v35.81,72.14 | v24.89,46.74 24.89,48.22 C5.1 25.15,48.48 25.15,49.02 25.75,49.62 U1.47
  Bottom 0.254: v35.81,72.14 35.05,71.37 35.05,50.55 31.75,47.24 25.4,47.24 v24.89,46.74
AIN2N  (via drill 0.3 pad 0.51)
  Top 0.254: U1.4 29.86,53.36 C4.1 31.15,52.07 v32.26,52.07 | R16.1 26.67,80.64 26.04,80.01 v26.04,72.39
  Bottom 0.254: v26.04,72.39 33.66,64.77 33.66,53.47 v32.26,52.07
AIN2P  (via drill 0.3 pad 0.51)
  Top 0.254: U1.5 31.06,53.86 C4.2 31.15,53.85 v32.26,53.85 | v24.77,72.39 R17.1
  Bottom 0.254: v24.77,72.39 24.77,71.5 32.26,64.01 v32.26,53.85
AN15V  (1 unrouted)
  pour Bottom (isolate 0.254, no thermals): 48.51,89.66 55.12,89.66 55.12,76.45 48.51,76.45
  pour Bottom (isolate 0.254, no thermals): 48.51,68.83 60.71,68.83 60.71,124.71 45.47,124.71 45.47,120.14 54.86,120.14 54.86,82.55 51.31,82.55 48.51,76.45
AN22VU  (1 unrouted)
AP15V  (via drill 0.89 pad 1.27)  (1 unrouted)
  Top 1.016: J1.1L 1.02,81.53 1.02,86.61 v4.44,90.04
  Bottom 0.61: C29.1 6.48,90.3 8.07,91.89 U3.1 10.61,91.89 10.92,92.2 10.92,93.47 10.61,93.79 U3.3
  Bottom 1.27: v4.44,90.04 C29.1
  pour Top (isolate 0.254, no thermals): 51.31,76.71 60.71,76.71 60.71,111 51.18,111 51.18,106.17 51.31,106.17
AP22VU  (1 unrouted)
BCK
  Top 0.254: U1.25 12.28,57.36 12.06,57.15 R29.2
BCK_CONN
  Top 0.254: J1.9L R29.1
D3V3  (1 unrouted)
D3V3_ECL  (via drill 0.3 pad 0.51, 0.51 pad 0.81)
  Top 0.254: 31.36,11.56 U6.4 | 31.36,11.56 31.88,11.56 | U6.5 31.37,12.06 31.36,11.56 | 28.08,14.11 U6.14 28.08,14.62 28.57,15.11 29.08,15.11 29.59,15.62 29.59,16.2 C36.1 | U6.17 26.58,13.62 | 26.58,13.62 27.05,14.1 | 26.58,13.62 26.54,13.59
  Bottom 0.254: 35.43,9.53 35.43,8 v36.2,7.24
  other vias: 34.92,5.97 36.2,5.97 37.47,5.97 37.47,7.24 22.73,5.97 21.46,5.97 20.19,5.97 20.19,7.24 21.46,7.24 36.2,15.88 37.47,15.88 37.47,17.14 36.2,17.14 34.92,17.14 21.46,15.62 20.19,15.62 20.19,16.89 21.46,16.89 22.73,16.89 32.13,19.68 34.92,18.41 36.2,18.41 37.47,18.41 25.53,11.81 24.51,11.81 23.5,11.81 22.48,11.81
  pour Top (isolate 0.254, no thermals): 31.62,24.77 29.08,24.77 29.08,17.91 34.16,17.91 34.16,14.86 38.48,14.86 38.48,19.18 33.66,19.18 31.62,21.21
  pour Bottom: 38.48,21.46 19.18,21.46 19.18,5.21 23.5,5.21 23.5,10.29 26.29,10.29 26.29,12.83 23.5,12.83 23.5,18.92 34.16,18.92 34.16,12.83 31.37,12.83 31.37,9.78 34.16,9.78 34.16,5.21 38.48,5.21
  pour Top (no thermals): 31.37,15.11 29.08,15.11 29.08,18.16 31.37,18.16
  pour Top (no thermals): 23.5,5.21 19.18,5.21 19.18,8.76 23.5,8.76
  pour Top (no thermals): 23.5,14.86 19.18,14.86 19.18,17.4 23.5,17.4
  pour Top (no thermals): 38.48,5.21 34.16,5.21 34.16,8.76 38.48,8.76
  pour Top: 31.11,10.29 31.11,9.02 34.42,9.02 34.42,7.75 38.48,7.75 38.48,10.29
  pour Top (no thermals): 31.11,12.32 31.11,11.3 38.48,11.3 38.48,14.86 34.16,14.86 34.16,14.35 32.13,12.32
  pour Top (no thermals): 27.3,14.35 27.3,12.83 22.48,12.83 21.46,13.84 21.46,15.11 23.5,15.11 23.5,14.35
  pour Top (no thermals): 26.8,11.3 26.8,12.32 21.46,12.32 21.46,11.05 26.54,11.05
  pour Top (no thermals): 29.59,8.26 29.59,9.78 27.05,9.78 26.54,10.29 21.21,10.29 21.21,8.76 23.5,8.26
D3V3ADC  (via drill 0.3 pad 0.51)
  Top 0.254: U1.21 U1.22 U1.23 U1.24 20.75,59.27 v19.05,60.96 | U1.45 24.75,50.27 v24.26,49.78 | C3.1 26.25,60.74 26.8,60.2 v27.69,60.2
  Top 0.305: U1.17 24.25,59.21 C3.1
  Bottom 0.254: v19.05,60.96 26.92,60.96 v27.69,60.2 27.69,53.21 v24.26,49.78
  pour Top (no thermals): 24.26,58.67 24.38,58.67 25.27,59.56 26.54,59.56 26.92,59.94 26.92,60.71 28.45,62.23 28.45,65.79 25.65,65.79 25.65,60.58 24.26,59.18
D7VU  (1 unrouted)
  pour Top (isolate 0.254, no thermals): 21.59,25.4 2.67,25.4 2.67,27.94 18.54,28.19 18.54,29.97 21.59,29.97
DGND  (via drill 0.3 pad 0.51, 0.51 pad 0.51, 0.51 pad 0.81)
  Top 0.254: 30.58,13.56 U6.9 | 30.58,13.56 U6.8 | U6.11 29.58,13.09 v29.84,12.83 | v29.84,12.83 30.58,13.56 | U6.10 30.08,13.06 | 30.08,13.06 v29.84,12.83 | 30.08,13.06 U6.7 | U6.13 28.58,13.08 v28.83,12.83 29.08,13.08 U6.12 | v27.81,12.83 27.58,13.06 U6.15 | U6.EXP v28.83,10.79 | v27.81,10.79 27.81,10.67 | U6.31 30.08,10.56 v29.84,10.79 | v26.04,9.27 26.32,9.56 U6.25 | C44.2 27.56,19.17 v26.29,17.91
  Top 0.61: U8.4 32.89,26.54 32.77,26.67
  Bottom 0.254: v26.04,7.24 v26.04,9.27 | J1.8R 57.91,59.69 58.42,59.18 58.42,52.07 | 58.42,49.53 58.42,37.59 57.66,36.83 J1.17R | 58.42,49.53 58.42,52.07 | 58.42,52.07 J1.11R | 58.42,49.53 J1.12R
  other vias: 33.15,16.38 32.13,16.38 25.27,17.91 24.26,17.91 25.27,16.89 26.29,15.88 26.29,16.89 28.83,11.81 24.26,16.89 32.89,5.97 27.81,11.81 29.84,11.81 31.62,7.24 31.62,5.97 26.04,5.97 24.77,5.97 31.75,28.19 31.75,26.67 30.23,28.19 30.23,26.67 24.38,28.96 24.38,27.69 24.38,26.42 24.38,25.15 23.11,28.96 23.11,27.69 23.11,26.42 23.11,25.15 36.58,28.45 36.58,27.18 35.31,28.45 35.31,27.18 43.18,32.77 41.91,32.77 40.64,32.77 39.37,32.77 38.1,32.77 9.91,23.88 9.91,22.61 9.91,21.34 9.91,20.07 10.92,20.07 10.92,21.34 10.92,22.61 10.92,23.88
  pour Bottom: 33.66,5.21 24,5.21 24,9.53 26.8,9.53 26.8,13.34 24,13.34 24,18.41 33.66,18.41 33.66,13.34 30.86,13.34 30.86,9.27 33.66,9.27
  pour Top (no thermals): 33.66,7.75 24,7.75 24,5.21 33.66,5.21
  pour Top (no thermals): 24,14.86 24,18.67 28.32,18.67 28.32,14.86
  pour Top (no thermals): 33.66,14.86 33.66,17.14 31.88,17.14 31.88,14.86
  pour Top (no thermals): 26.54,5.21 26.54,2.67 15.88,2.67 15.88,6.48 18.41,6.48 18.41,4.7 24,4.7 24,5.21
  pour Top (isolate 0.254, no thermals): 27.94,29.72 27.94,18.8 9.4,18.8 9.4,24.51 22.23,24.51 22.23,29.72
  pour Top: 22.86,24.38 19.3,24.38 19.3,22.61 22.86,22.61
  pour Top (isolate 0.254, no thermals): 43.94,33.53 43.94,26.67 37.08,26.67 37.08,21.34 34.04,21.34 34.04,25.91 29.72,25.91 29.72,28.7 33.27,28.7 33.27,33.53
  pour Bottom (isolate 0.254, no thermals): 0.25,60.71 0.25,0.25 60.71,0.25 60.71,38.1 47.24,38.1 45.21,36.07 21.84,36.07 21.84,22.61 39.62,22.61 39.62,4.06 33.53,4.06 33.53,5.59 24.13,5.59 24.13,4.06 17.78,4.06 17.78,15.49 11.43,21.84 11.43,60.71
  pour Top (isolate 0.254, no thermals): 14.22,32 24.64,32 24.64,29.21 22.23,29.21 22.23,30.48 14.22,30.48
  pour Top (isolate 0.254, no thermals): 8.38,35.56 10.41,35.56 10.41,39.37 15.75,39.37 15.75,36.07 18.03,36.07 18.03,28.7 8.38,28.7
ILN  (via drill 0.3 pad 0.51)
  Top 0.254: U5.5 v31.11,114.3 | SV1.2 38.73,125.73 37.47,124.46 37.47,121.28 36.62,120.44 R5.2 35.56,118.33 v35.56,114.3
  Bottom 0.254: v31.11,114.3 v35.56,114.3
ILNB
  Top 0.254: U5.6 U5.7 33.66,106.68 34.67,105.66 R8.2
ILP
  Top 0.254: U5.10 31.11,118.75 35.01,122.64 R6.2 35.05,124.59 36.2,125.73 SV1.3
ILPB
  Top 0.254: U5.9 U5.8 33.66,114.3 35.56,112.39 35.56,109.22 36.41,108.37 R7.2
IN5V  (via drill 0.3 pad 0.51)
  other vias: 29.08,74.93 29.08,73.91 28.07,73.91 28.07,74.93 39.24,75.18 40.26,75.18 40.26,74.17 39.24,74.17
  pour Top (isolate 0.254, no thermals): 31.37,87.88 31.37,87.38 32.64,87.38 36.2,83.82 38.73,83.82 38.73,72.9 40.77,72.9 40.77,85.6 35.94,85.6 35.18,86.36 35.18,87.63 33.4,87.63 33.15,87.88
  pour Top (isolate 0.254, no thermals): 29.59,86.11 29.59,85.09 28.32,83.82 28.32,81.03 27.05,79.76 27.05,72.9 29.59,72.9 29.59,83.31 30.1,83.82 30.1,86.11
  pour Bottom (isolate 0.254, no thermals): 40.77,75.69 27.05,75.69 27.05,72.9 40.77,72.9
  pour Bottom (isolate 0.254, no thermals): 47.5,95 43.94,95 43.94,75.69 40.13,75.69 40.13,72.9 47.5,72.9
IP5V  (via drill 0.3 pad 0.51)
  Top 0.254: U2.14 29.09,85.1 27.81,83.82 27.81,80.77 v27.56,80.52 | U2.20 32.63,86.88 35.94,83.57 v37.97,83.57 | v22.99,80.52 22.99,84.33 | v41.27,83.57 v41.27,103.12
  Bottom 0.254: v22.99,80.52 v27.56,80.52 | v37.97,83.57 v41.27,83.57 | v41.27,103.12 32.38,103.12
  other vias: 32.13,104.39 32.13,103.38 31.11,103.38 31.11,104.39 18.92,104.39 18.92,103.38 17.91,103.38 17.91,104.39 17.91,93.47 18.92,93.47 18.92,92.46 17.91,92.46 17.91,91.44 18.92,91.44 18.92,90.42 17.91,90.42
  pour Top (isolate 0.254, no thermals): 30.1,89.15 30.1,92.46 31.11,93.47 31.11,97.79 32.64,99.31 32.64,104.9 30.1,104.9 30.1,93.73 29.59,93.22 29.59,89.15
  pour Top (isolate 0.254, no thermals): 28.32,87.88 26.04,87.88 25.78,87.63 24.77,87.63 24.51,87.38 24.51,86.36 24,85.85 19.43,85.85 19.43,104.9 17.4,104.9 17.4,83.82 23.24,83.82 26.8,87.38 28.32,87.38
  pour Bottom (isolate 0.254, no thermals): 32.64,102.87 17.4,102.87 17.4,104.9 32.64,104.9
  pour Bottom (isolate 0.254, no thermals): 11.18,93.98 11.18,87.38 19.3,87.38 19.3,93.98
IRN
  Top 0.254: U5.12 28.57,118.75 25.61,121.7 R2.2 25.61,123.61 23.5,125.73 SV2.2
IRNB
  Top 0.254: U5.13 U5.14 26.04,114.3 24.13,112.39 24.13,109.22 22.23,107.31 22.23,96.52 23.28,95.47 R10.2
IRP  (via drill 0.3 pad 0.51)
  Top 0.254: U5.3 v28.57,114.3 | SV2.3 20.95,123.83 23.07,121.7 R4.2 24.13,118.33 v24.13,114.3
  Bottom 0.254: v28.57,114.3 v24.13,114.3
IRPB
  Top 0.254: U5.2 U5.1 26.04,109.22 23.5,106.68 23.5,97.79 25.02,96.27 R9.2
LRCK
  Top 0.254: U1.26 15.84,56.86 13.08,54.1 R28.2
LRCK_CONN
  Top 0.254: J1.11L 6.52,52.07 R28.1
MCLK  (via drill 0.3 pad 0.51)
  Top 0.254: R26.1 v17.65,18.16 | U1.16 24.75,58.53 25.15,58.93 v26.42,58.93
  Bottom 0.254: v17.65,18.16 17.65,26.16 15.37,28.45 15.37,56.52 17.78,58.93 v26.42,58.93
MCLKN
  Top 0.254: 43.9,12.06 C33.2 44.41,11.05 46.48,11.05 49.78,14.35 49.78,31.11 51.94,33.27 54.86,33.27 J1.18R
MCLKP
  Top 0.254: 43.9,9.53 C34.2 44.41,10.54 46.74,10.54 50.29,14.1 50.29,30.86 52.2,32.77 54.86,32.77 J1.19R
MOSI
  Top 0.254: J1.18L 3.17,34.29 2.54,34.92 2.54,37.47 3.17,38.1 6.99,38.1 7.62,38.73 7.62,43.81 18.16,54.36 U1.31
N$1  (via drill 0.3 pad 0.51, 0.51 pad 0.81)
  other vias: 30.48,123.32 31.37,123.32 32.26,123.32 30.48,122.43 31.37,122.43 32.26,122.43 42.16,124.08 43.18,124.08 44.2,124.08 42.16,122.94 43.18,122.94 42.16,121.79 43.18,121.79
  pour Top (isolate 0.254, no thermals): 32.51,123.7 32.51,121.54 31.11,120.14 31.11,119.63 30.35,118.87 30.35,115.82 29.34,115.82 29.34,118.87 30.1,119.63 30.1,123.7
  pour Bottom (no thermals): 44.7,124.59 30.23,124.59 30.23,120.4 44.7,120.4
  pour Top (no thermals): 46.35,115.32 46.35,124.71 41.66,124.71 41.66,115.32
N$2
  Top 0.254: U2.24 31.86,88.88 33.91,90.93 34.58,90.93 R7.1 34.71,90.6 R11.2
N$3
  Top 0.254: U2.18 31.09,84.69 R15.2
N$4
  Top 0.254: U2.19 32.37,86.38 34.16,84.58 34.16,83.53 R14.2
N$5
  Top 0.254: U2.13 28.59,85.33 R16.2
N$6
  Top 0.254: U2.12 26.82,86.38 24.77,84.33 R17.2
N$7
  Top 0.254: U2.1 31.09,89.9 34.67,93.47 R8.1 32.97,96.23 R18.2
N$8
  Top 0.254: U2.6 28.59,89.9 25.02,93.47 R9.1 26.72,96.23 R19.2
N$9  (via drill 3.17 pad 6.35)
  other vias: 5.08,126.36
N$10  (via drill 3.17 pad 6.35)
  other vias: 55.88,126.36
N$11
  Top 0.254: U2.7 27.58,88.88 25.78,90.68 25.11,90.68 | 25.11,90.68 R10.1 | 25.11,90.68 25.06,90.68 R20.2
N$12
  Top 0.254: U2.2 30.59,90.92 32.77,93.09 R18.1
N$13
  Top 0.254: U2.5 29.09,90.92 26.92,93.09 R19.1
N$14
  Top 0.254: U2.23 32.88,88.38 33.4,88.9 R11.1
N$15
  Top 0.254: U2.8 26.81,88.38 26.29,88.9 R20.1
N$16
  Top 0.254: R21.2 38.9,9.78 | U6.2 38.37,10.56 R21.2 | R21.2 41.78,9.95 C34.1
N$17
  Top 0.254: U6.3 38.41,11.06 R21.1 41.78,11.64 C33.1
N$18
  Top 0.254: U6.23 21.57,10.56 R23.2
N$19
  Top 0.61: U8.1 29.08,23.5 28.7,23.11 26.29,23.11 C41.1
N$20  (via drill 0.51 pad 0.81)
  other vias: 31.75,108.97 31.75,107.95 31.75,106.93 48.13,108.71 49.15,108.71 50.16,108.71 50.16,107.7 49.15,107.7 48.13,107.7
  pour Top (isolate 0.254, no thermals): 30.35,112.78 30.35,110.24 31.11,109.47 32.38,109.47 32.38,106.43 30.1,106.43 30.1,108.71 29.34,109.47 29.34,112.78
  pour Bottom (isolate 0.254, no thermals): 31.11,106.43 50.55,106.43 50.55,109.47 31.11,109.47
  pour Top (no thermals): 50.55,111 50.55,105.03 46.86,105.03 46.86,108.2 49.66,111
N$22
  Top 0.254: U6.19 22.58,12.56 20.79,14.35 18.58,14.35 R26.2
N$25
  Top 0.254: U6.22 21.54,11.06 R24.2
N$26
  Top 0.61: U8.3 31.62,22.73 33.78,20.57 35.24,20.57 C43.1 35.12,20.57
  Top 1.27: C43.1 37.56,20.64 C45.+
N$27
  Top 0.254: U6.32 33.37,9.56 33.91,9.02 33.91,5.21 33.06,4.36 R22.2
N$28
  Top 0.61: U8.6 U8.5 35.19,30.18 C42.1
N$29
  Top 0.254: R24.1 R23.1 18.16,8.85 18.16,7.75 18.25,7.58 R25.1 17.74,7.58
N$72
  Top 0.254: U15.7 38.85,54.48 39.88,55.5 40.01,55.5 C25.1
  pour Top (no thermals): 39.12,54.74 40.64,56.26 40.64,58.67 39.88,59.44 39.88,60.96 41.02,60.96 42.67,59.31 42.67,56.01 41.4,54.74
N$73
  Top 0.254: U16.7 20.57,41.41 22.61,39.37 22.73,39.37 C84.1
  pour Top (no thermals): 26.42,40.77 24.51,40.77 24,40.26 21.72,40.26 20.57,41.4 20.57,39.12 21.34,38.35 25.15,38.35 26.42,39.62
PREREG
  pour Top (isolate 0.254, no thermals): 18.54,32.51 25.15,32.51 25.15,30.48 28.7,30.48 28.7,29.46 30.73,29.46 30.73,35.05 18.54,35.05
SCLK  (via drill 0.3 pad 0.51)
  Top 0.254: U1.33 20.07,53.34 19.56,53.34 16.76,50.55 v16.76,48.01
  Bottom 0.254: v16.76,48.01 16.76,38.86 18.03,37.59 43.43,37.59 52.83,46.99 J1.13R
SDATA0
  Top 0.254: U1.28 18.39,55.86 14.35,51.82 R27.2
SDATA0_CONN
  Top 0.254: J1.12L 6.26,49.53 R27.1
SDATA1
  Top 0.254: U1.27 16.99,56.36 13.72,53.09 9.91,53.09 9.4,52.58 9.4,50.13 R30.2
SDATA1_CONN
  Top 0.254: J1.13L 6.26,46.99 R30.1
VDD18
  Top 0.254: U1.19
  Top 0.305: U1.19 23.24,59.09 C18.1
  pour Top (no thermals): 23.24,58.67 23.24,59.18 21.72,60.71 21.72,61.98 21.21,62.48 21.21,65.53 18.41,65.53 18.41,62.99 20.95,60.45 21.46,60.45
VOCM  (via drill 0.3 pad 0.51)
  Top 0.254: U2.11 28.11,86.87 v26.29,86.87 | v30.35,84.58 30.59,84.82 U2.17 | v38.35,70.87 23.5,70.87 v20.45,73.91
  Bottom 0.254: v30.35,84.58 28.57,84.58 v26.29,86.87 21.68,82.26 | v38.35,70.87 47.59,61.63 | v20.45,73.91 20.45,81.03 20.89,81.47 21.68,82.26 | 21.68,82.26 C20.1
  Bottom 1.016: R12.2 48.77,54.86 49.02,55.12 49.02,55.88 48.26,56.64 48.26,56.86 R13.1
  pour Bottom (isolate 0.254, no thermals): 47.5,61.72 47.5,50.55 51.31,50.55 51.31,61.72
VREF
  Top 0.254: 28.19,52.83 29.46,51.56 30.52,50.51 C1.1
  Top 0.305: U1.3 29.18,52.86 29.97,52.07 29.46,51.56
  Top 1.016: R31.2 27.41,43.94 C10.+
  pour Top (isolate 0.254, no thermals): 27.81,52.83 29.34,51.31 29.34,44.7 27.94,43.31 27.94,39.62 33.53,39.62 33.53,45.97 30.99,48.51 30.99,51.05 30.23,51.05 30.1,51.18 30.1,52.2 29.46,52.83

### Text on the board
tPlace: 2-channel ADC | (AK5572) | M. Price